# EAGLE schematic detector (EAGLE 9.0.1)
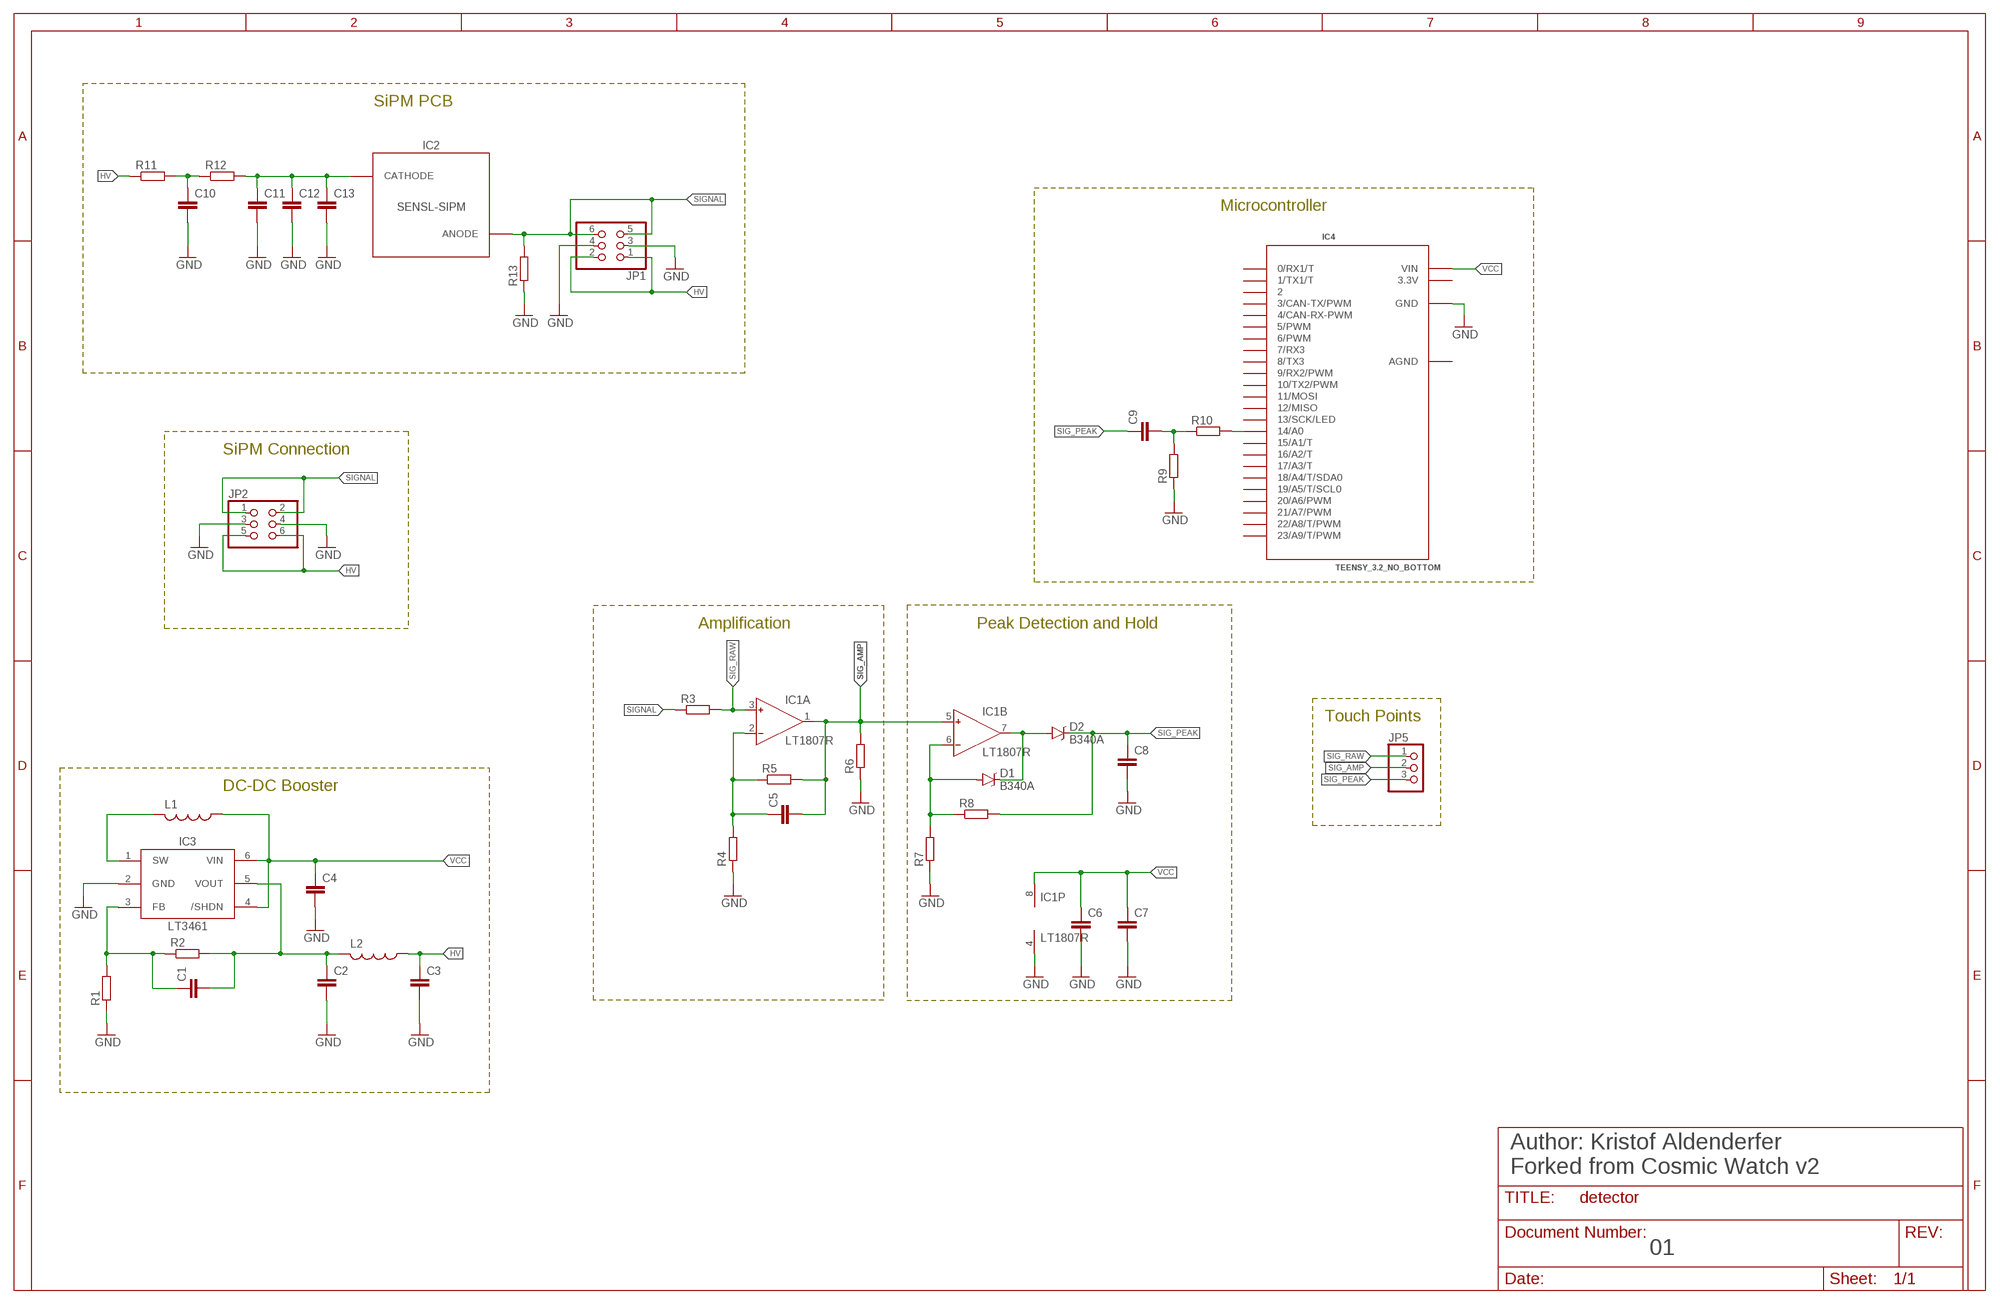
[diagram p0: schematic, sheet 1]

## Parts
C1  C-EUC0805  [C0805]
C2  C-EUC0805  [C0805]
C3  C-EUC0805  [C0805]
C4  C-EUC0805  [C0805]
C5  C-EUC0805  [C0805]
C6  C-EUC0805  [C0805]
C7  C-EUC0805  [C0805]
C8  C-EUC0805  [C0805]
C9  C-EUC0805  [C0805]
C10  C-EUC0805  [C0805]
C11  C-EUC0805  [C0805]
C12  C-EUC0805  [C0805]
C13  C-EUC0805  [C0805]
D1  B340A  DIODE-SCHOTTKY-B340A  [SMA-DIODE]
D2  B340A  DIODE-SCHOTTKY-B340A  [SMA-DIODE]
IC1  LT1807R  [SO8]
IC2  SENSL-SIPM  [MICROFC-60035]
IC3  LT3461  [SOT23-6]
IC4  TEENSY_3.2_NO_BOTTOM  [TEENSY_3.2_NO_BOTTOM]
JP1  PINHD-2X3  [2X03]
JP2  PINHD-2X3  [2X03]
JP5  PINHD-1X3  [1X03]
L1  L-USL2012C  [L2012C]
L2  L-USL2012C  [L2012C]
R1  R-EU_M0805  [M0805]
R2  R-EU_M0805  [M0805]
R3  R-EU_M0805  [M0805]
R4  R-EU_M0805  [M0805]
R5  R-EU_M0805  [M0805]
R6  R-EU_M0805  [M0805]
R7  R-EU_M0805  [M0805]
R8  R-EU_M0805  [M0805]
R9  R-EU_M0805  [M0805]
R10  R-EU_M0805  [M0805]
R11  R-EU_M0805  [M0805]
R12  R-EU_M0805  [M0805]
R13  R-EU_M0805  [M0805]

## Nets
GND: C2.2 C3.2 C4.2 C6.2 C7.2 C8.2 C10.2 C11.2 C12.2 C13.2 IC1.4(P:V-) IC3.2(GND) IC4.GND JP1.3 JP1.4 JP2.3 JP2.4 R1.1 R4.1 R6.1 R7.1 R9.1 R13.1
HV: C3.1 JP1.1 JP1.2 JP2.5 JP2.6 L2.1 R11.1
N$1: IC3.1(SW) L1.2
N$2: D1.C D2.A IC1.7(B:OUT)
N$3: C1.1 IC3.3(FB) R1.2 R2.1
N$4: D1.A IC1.6(B:IN-) R7.2 R8.1
N$5: C11.1 C12.1 C13.1 IC2.CATHODE R12.2
N$6: C10.1 R11.2 R12.1
N$7: C1.2 C2.1 IC3.5(VOUT) L2.2 R2.2
N$8: C5.1 IC1.2(A:IN-) R4.2 R5.1
N$9: C9.2 R9.2 R10.1
N$10: IC4.14/A0 R10.2
SIG_AMP: C5.2 IC1.1(A:OUT) IC1.5(B:IN+) JP5.2 R5.2 R6.2
SIG_PEAK: C8.1 C9.1 D2.C JP5.3 R8.2
SIG_RAW: IC1.3(A:IN+) JP5.1 R3.2
SIGNAL: IC2.ANODE JP1.5 JP1.6 JP2.1 JP2.2 R3.1 R13.2
VCC: C4.1 C6.1 C7.1 IC1.8(P:V+) IC3.4(/SHDN) IC3.6(VIN) IC4.VIN L1.1
Unconnected: IC4.0(0/RX1/T) IC4.1(1/TX1/T) IC4.2 IC4.3(3/CAN-TX/PWM) IC4.4(4/CAN-RX-PWM) IC4.5(5/PWM) IC4.6(6/PWM) IC4.7(7/RX3) IC4.8(8/TX3) IC4.9(9/RX2/PWM) IC4.10(10/TX2/PWM) IC4.11(11/MOSI) IC4.12(12/MISO) IC4.13(13/SCK/LED) IC4.15/A1(15/A1/T) IC4.16/A2(16/A2/T) IC4.17/A3(17/A3/T) IC4.18/A4(18/A4/T/SDA0) IC4.19/A5(19/A5/T/SCL0) IC4.20/A6(20/A6/PWM) IC4.21/A7(21/A7/PWM) IC4.22/A8(22/A8/T/PWM) IC4.23/A9(23/A9/T/PWM)

## Notes on the sheet
- SiPM PCB
- Microcontroller
- SiPM Connection
- Amplification | Peak Detection and Hold
- Touch Points
- DC-DC Booster
- Author: Kristof Aldenderfer
  Forked from Cosmic Watch v2
- 01

## Power pins joined to a net without a drawn wire
3.3V: IC4.3.3V
AGND: IC4.AGND

## Library data of the parts
C1-C13 = rcl:C-EU: CAPACITOR, European symbol; SPICEPREFIX: C
D1 D2 = SparkFun-DiscreteSemi:DIODE-SCHOTTKY: Schottky diodes in SFE's production catalog BAT20J 1A 23V 0.62Vf RB751 120mA 40V 0.37Vf PMEG4005EJ 0.5A 40V 0.42Vf MBRA140 1A 40V 0.5Vf B340A 3A 40V SMA; PROD_ID: DIO-09886
IC1 = personal:LT1807: Dual Precision, 500 ns Settling, BiFET Op Amp Source: http://www.analog.com/static/imported-files/data_sheets/AD746.pdf; MF: ALTERA CORPORATION; MPN: AD746JRZ; OC_FARNELL: 1423876; OC_NEWARK: 59K4845
IC2 = personal:SENSL-SIPM
IC3 = personal:LT3461: LT3426 1.2MHz, 2A boost converter in SOT-23 http://www.linear.com/pc/productDetail.jsp?navId=H0,C1,C1003,C1042,C1031,C1061,P8430 (Linear website)
IC4 = personal:TEENSY_3.2_NO_BOTTOM: Footprint for Teensy 3.1 board using all pin connections on the outer perimeter
JP1 JP2 = pinhead:PINHD-2X3: PIN HEADER
JP5 = pinhead:PINHD-1X3: PIN HEADER
L1 L2 = rcl:L-US: INDUCTOR, American symbol; SPICEPREFIX: L
R1-R13 = rcl:R-EU_: RESISTOR, European symbol; SPICEPREFIX: R